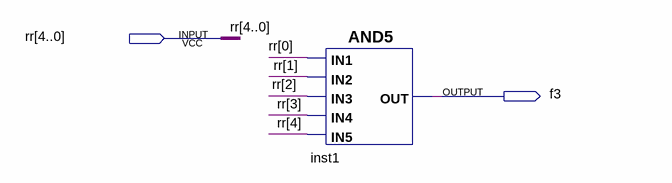
[diagram p0: schematic sheet]
// Quartus schematic KC4.bdf as structural Verilog: 1 symbols, 2 pins
module KC4 (
  input  [4:0] rr,
  output f3
);

  and inst1 (f3, rr[0], rr[1], rr[2], rr[3], rr[4]);
endmodule
